# EAGLE schematic Simulated02 (EAGLE 9.5.2)
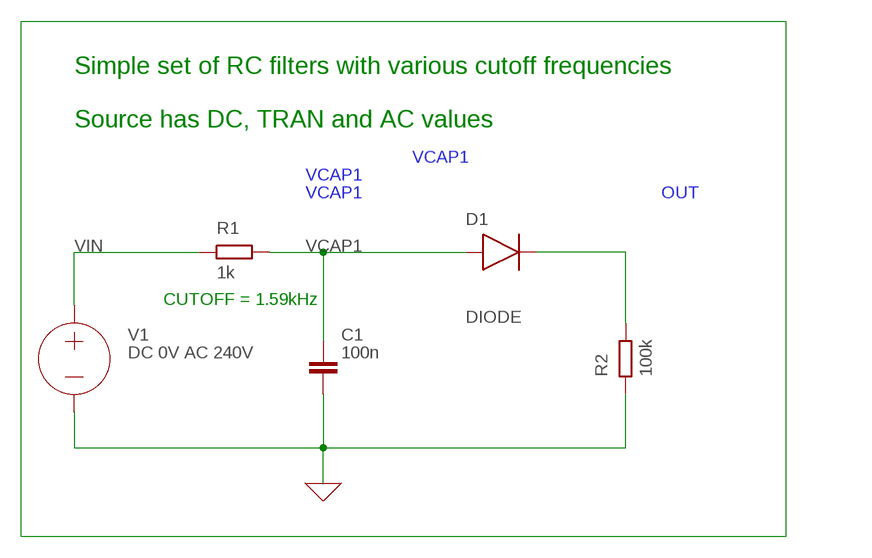
[diagram p0: schematic, sheet 1]

## Parts
C1  100n  C  (no package)
D1  DIODE  (no package)
R1  1k  R  (no package)
R2  100k  R  (no package)
V1  DC 0V AC 240V  VOLTAGE  (no package)

## Nets
0: C1.2 R2.1 V1.- ; supply symbol labelled GND
OUT: D1.C R2.2
VCAP1: C1.1 D1.A R1.2
VIN: R1.1 V1.+

## Notes on the sheet
- Simple set of RC filters with various cutoff frequencies
  
  Source has DC, TRAN and AC values
- CUTOFF = 1.59kHz

## Library data of the parts
C1 = ngspice-simulation:C: CAPACITOR
D1 = ngspice-simulation:DIODE: Diode
R1 R2 = ngspice-simulation:R: RESISTOR
V1 = ngspice-simulation:VOLTAGE: Independent Voltage Source, either DC, AC, PULSE, SINE, PWL, EXP, or SFFM; VALUE: 0V